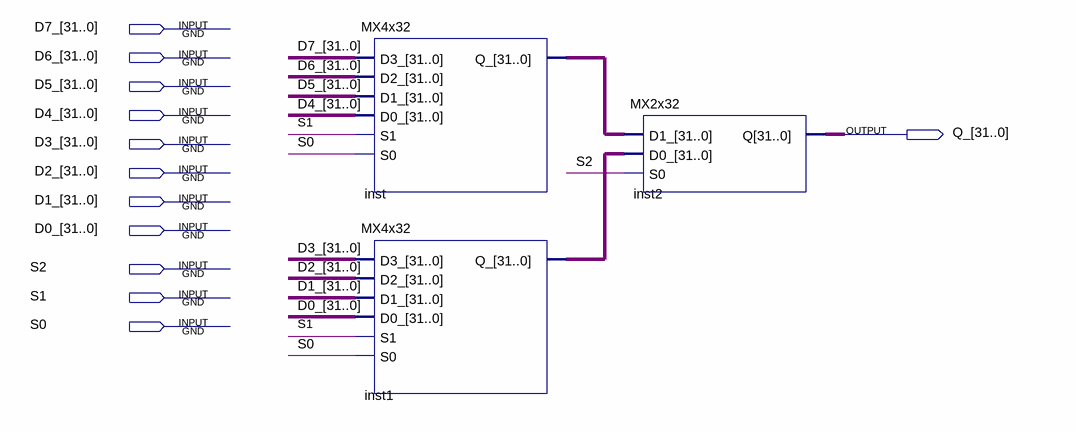
[diagram p0: schematic sheet]
// Quartus schematic MX8x32.bdf as structural Verilog: 3 symbols, 12 pins
module MX8x32 (
  input  [31:0] D7_,
  input  [31:0] D6_,
  input  [31:0] D5_,
  input  [31:0] D4_,
  input  [31:0] D3_,
  input  [31:0] D2_,
  input  [31:0] D1_,
  input  [31:0] D0_,
  input  S2,
  input  S1,
  input  S0,
  output [31:0] Q_
);

  wire [31:0] inst1_q_, inst_q_;

  MX4x32 inst (.D3_(D7_), .D2_(D6_), .D1_(D5_), .D0_(D4_), .S1(S1), .S0(S0), .Q_(inst_q_));
  MX4x32 inst1 (.D3_(D3_), .D2_(D2_), .D1_(D1_), .D0_(D0_), .S1(S1), .S0(S0), .Q_(inst1_q_));
  MX2x32 inst2 (.D1_(inst_q_), .D0_(inst1_q_), .S0(S2), .Q(Q_));
endmodule
